# EAGLE design PDM_2019_RevB (EAGLE 9.1.3)

## Sheet 1 of 4
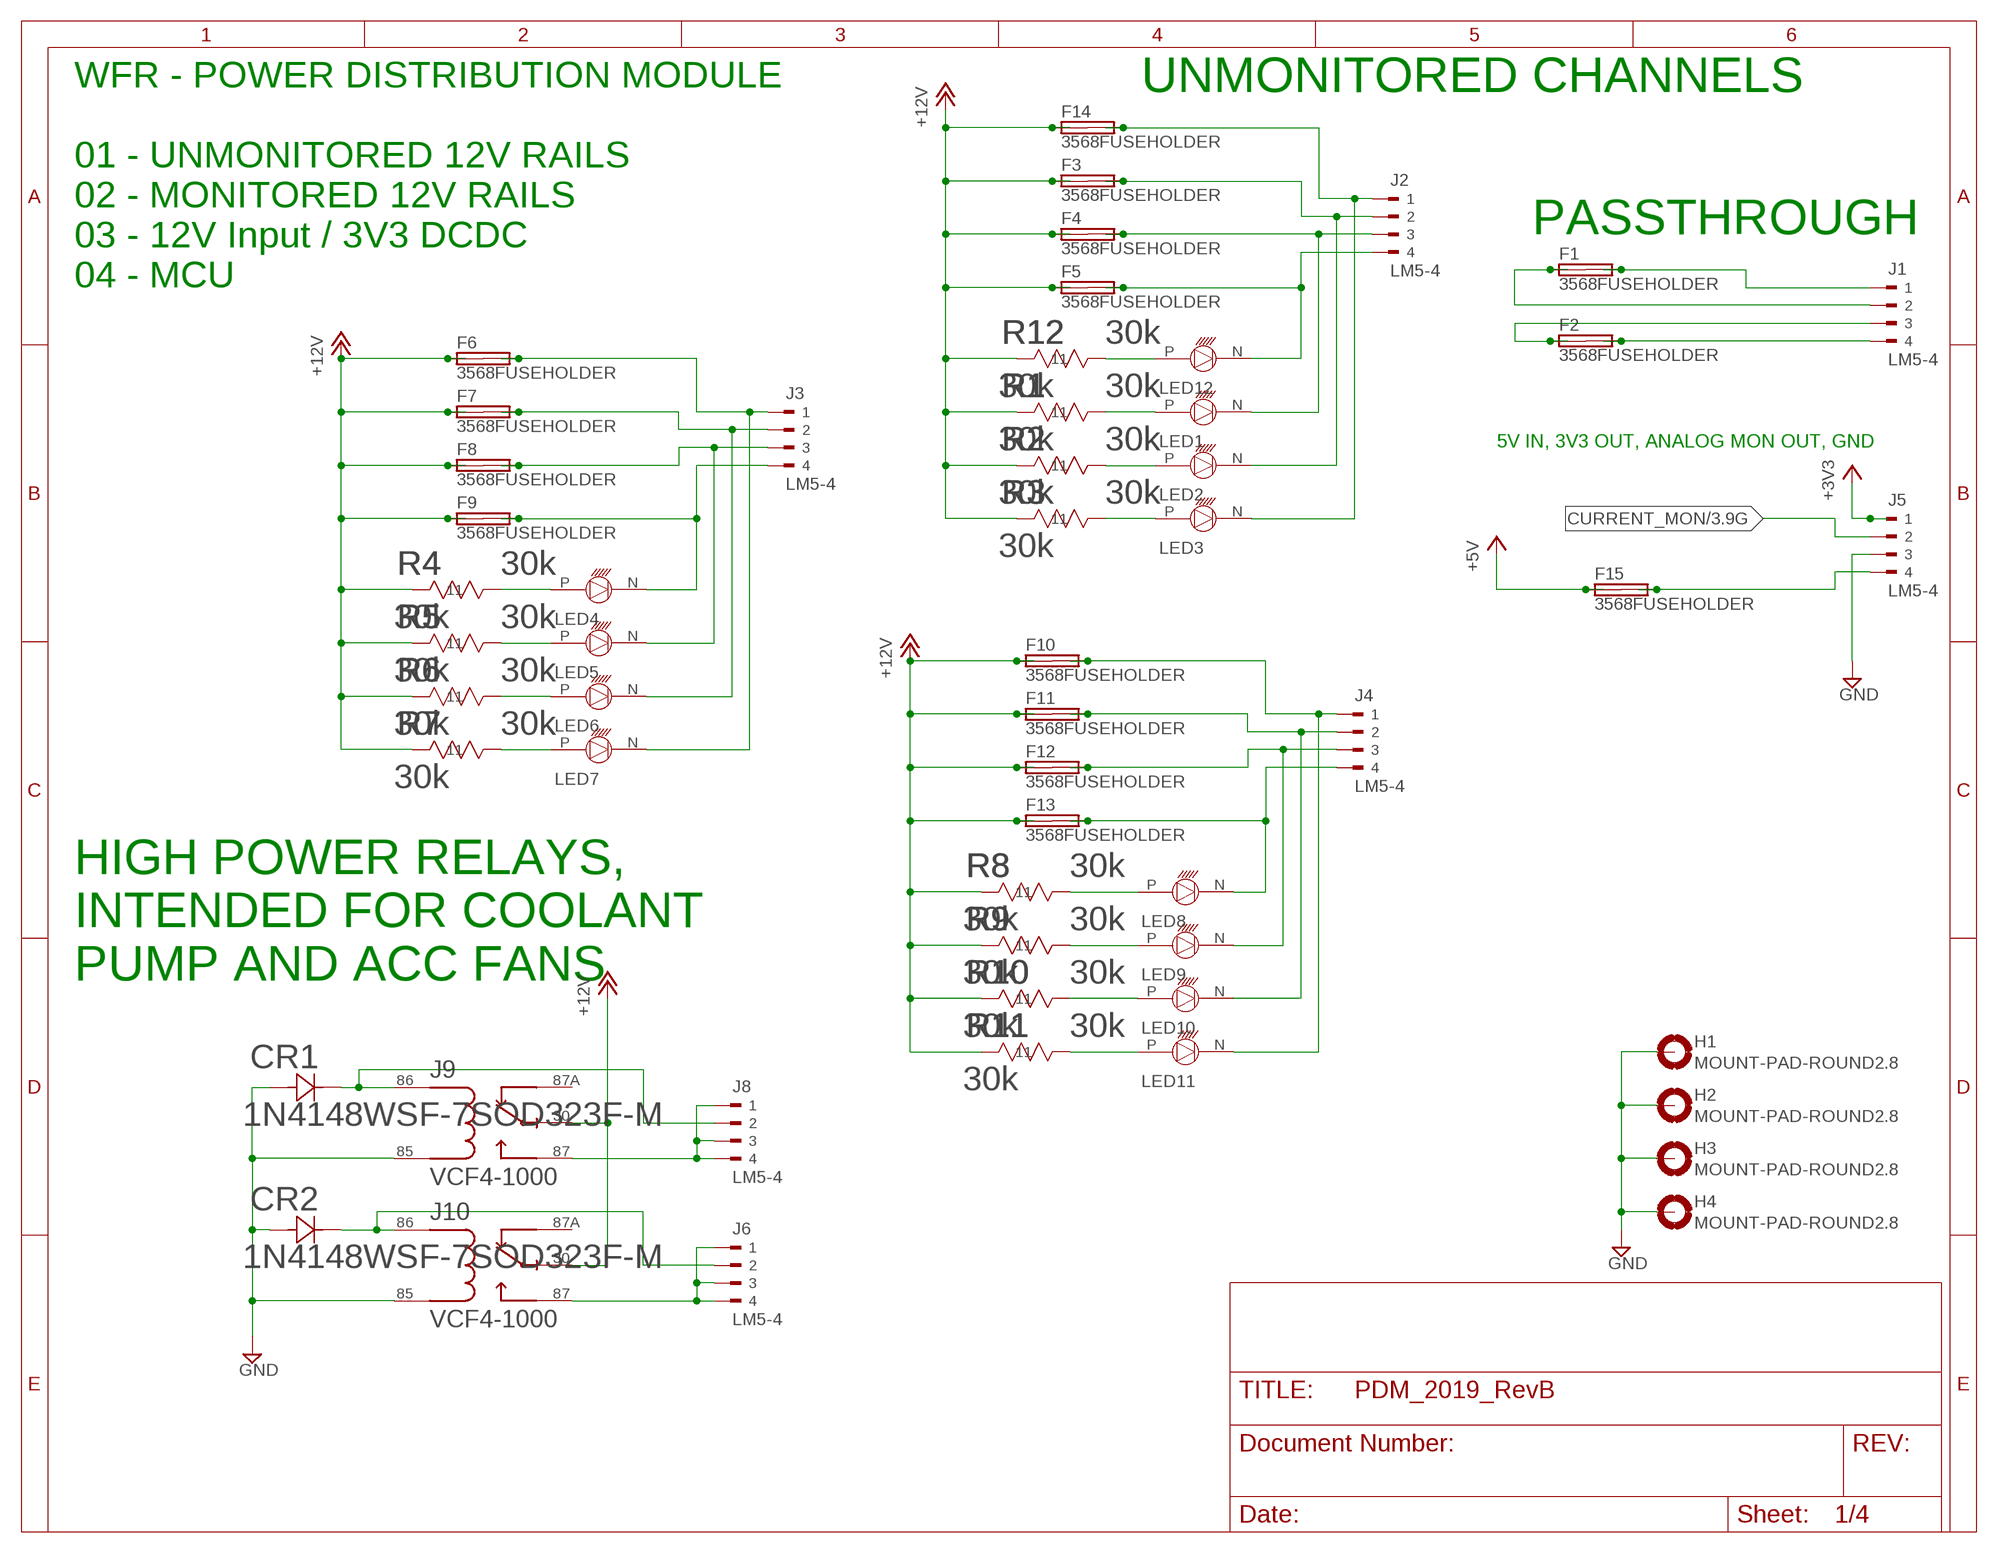
[diagram p0: schematic, sheet 1]

### Parts
CR1  1N4148WSF-7SOD323F-M  [SOD323F-M]
CR2  1N4148WSF-7SOD323F-M  [SOD323F-M]
F1  3568FUSEHOLDER  [3568]
F2  3568FUSEHOLDER  [3568]
F3  3568FUSEHOLDER  [3568]
F4  3568FUSEHOLDER  [3568]
F5  3568FUSEHOLDER  [3568]
F6  3568FUSEHOLDER  [3568]
F7  3568FUSEHOLDER  [3568]
F8  3568FUSEHOLDER  [3568]
F9  3568FUSEHOLDER  [3568]
F10  3568FUSEHOLDER  [3568]
F11  3568FUSEHOLDER  [3568]
F12  3568FUSEHOLDER  [3568]
F13  3568FUSEHOLDER  [3568]
F14  3568FUSEHOLDER  [3568]
F15  3568FUSEHOLDER  [3568]
H1  MOUNT-PAD-ROUND2.8  [2,8-PAD]
H2  MOUNT-PAD-ROUND2.8  [2,8-PAD]
H3  MOUNT-PAD-ROUND2.8  [2,8-PAD]
H4  MOUNT-PAD-ROUND2.8  [2,8-PAD]
J1  LM5-4  [281-1423]
J2  LM5-4  [281-1423]
J3  LM5-4  [281-1423]
J4  LM5-4  [281-1423]
J5  LM5-4  [281-1423]
J6  LM5-4  [281-1423]
J8  LM5-4  [281-1423]
J9  VCF4-1000  [TE_VCF4-1000]
J10  VCF4-1000  [TE_VCF4-1000]
LED1  5MM_LED  [5MM_LED]
LED2  5MM_LED  [5MM_LED]
LED3  5MM_LED  [5MM_LED]
LED4  5MM_LED  [5MM_LED]
LED5  5MM_LED  [5MM_LED]
LED6  5MM_LED  [5MM_LED]
LED7  5MM_LED  [5MM_LED]
LED8  5MM_LED  [5MM_LED]
LED9  5MM_LED  [5MM_LED]
LED10  5MM_LED  [5MM_LED]
LED11  5MM_LED  [5MM_LED]
LED12  5MM_LED  [5MM_LED]
R1  30k  RMCF0805JT30K0  [STA_RMCF0805]
R2  30k  RMCF0805JT30K0  [STA_RMCF0805]
R3  30k  RMCF0805JT30K0  [STA_RMCF0805]
R4  30k  RMCF0805JT30K0  [STA_RMCF0805]
R5  30k  RMCF0805JT30K0  [STA_RMCF0805]
R6  30k  RMCF0805JT30K0  [STA_RMCF0805]
R7  30k  RMCF0805JT30K0  [STA_RMCF0805]
R8  30k  RMCF0805JT30K0  [STA_RMCF0805]
R9  30k  RMCF0805JT30K0  [STA_RMCF0805]
R10  30k  RMCF0805JT30K0  [STA_RMCF0805]
R11  30k  RMCF0805JT30K0  [STA_RMCF0805]
R12  30k  RMCF0805JT30K0  [STA_RMCF0805]

### Nets
+3V3 [SIG]: J5.P$1 ; also sheet 3
+5V [SIG]: F15.L1(1A) F15.L2(1B) ; also sheet 2,3,4
+12V: F3.L1(1A) F3.L2(1B) F4.L1(1A) F4.L2(1B) F5.L1(1A) F5.L2(1B) F6.L1(1A) F6.L2(1B) F7.L1(1A) F7.L2(1B) F8.L1(1A) F8.L2(1B) F9.L1(1A) F9.L2(1B) F10.L1(1A) F10.L2(1B) F11.L1(1A) F11.L2(1B) F12.L1(1A) F12.L2(1B) F13.L1(1A) F13.L2(1B) F14.L1(1A) F14.L2(1B) J9.30 J10.30 R1.1 R2.1 R3.1 R4.1 R5.1 R6.1 R7.1 R8.1 R9.1 R10.1 R11.1 R12.1 ; also sheet 2,3
CURRENT_MON [SIG]: J5.P$2 ; also sheet 3,4
GND [SIG]: CR1.2 CR2.2 H1.B2,8(MOUNT) H2.B2,8(MOUNT) H3.B2,8(MOUNT) H4.B2,8(MOUNT) J5.P$3 J9.85 J10.85 ; also sheet 2,3,4
N$1: F1.R1(2A) F1.R2(2B) J1.P$1
N$2: F1.L1(1A) F1.L2(1B) J1.P$2
N$3: F2.L1(1A) F2.L2(1B) J1.P$3
N$4: LED11.P R11.2
N$5: LED12.P R12.2
N$6: F4.R1(2A) F4.R2(2B) J2.P$3 LED1.N
N$7: F5.R1(2A) F5.R2(2B) J2.P$4 LED12.N
N$9: F6.R1(2A) F6.R2(2B) J3.P$1 LED7.N
N$11: F8.R1(2A) F8.R2(2B) J3.P$3 LED5.N
N$12: F7.R1(2A) F7.R2(2B) J3.P$2 LED6.N
N$13: F10.R1(2A) F10.R2(2B) J4.P$1 LED11.N
N$14: F13.R1(2A) F13.R2(2B) J4.P$4 LED8.N
N$15: F12.R1(2A) F12.R2(2B) J4.P$3 LED9.N
N$16: F11.R1(2A) F11.R2(2B) J4.P$2 LED10.N
N$18: F15.R1(2A) F15.R2(2B) J5.P$4
N$19: LED10.P R10.2
N$21: LED8.P R8.2
N$22: CR2.1 J6.P$2 J10.86
N$23: CR1.1 J8.P$2 J9.86
N$24: LED9.P R9.2
N$25: F2.R1(2A) F2.R2(2B) J1.P$4
N$26: LED7.P R7.2
N$27: LED6.P R6.2
N$28: LED5.P R5.2
N$29: LED4.P R4.2
N$30: LED1.P R1.2
N$31: LED2.P R2.2
N$32: LED3.P R3.2
N$33: F3.R1(2A) F3.R2(2B) J2.P$2 LED2.N
N$34: F14.R1(2A) F14.R2(2B) J2.P$1 LED3.N
N$40: J6.P$1 J6.P$3 J6.P$4 J10.87
N$41: F9.R1(2A) F9.R2(2B) J3.P$4 LED4.N
N$43: J8.P$1 J8.P$3 J8.P$4 J9.87
Unconnected: J9.87A J10.87A

### Notes on the sheet
- UNMONITORED CHANNELS
- PASSTHROUGH
- WFR - POWER DISTRIBUTION MODULE
  
  01 - UNMONITORED 12V RAILS
  02 - MONITORED 12V RAILS
  03 - 12V Input / 3V3 DCDC
  04 - MCU
- 5V IN, 3V3 OUT, ANALOG MON OUT, GND
- HIGH POWER RELAYS,
  INTENDED FOR COOLANT 
  PUMP AND ACC FANS

## Sheet 2 of 4
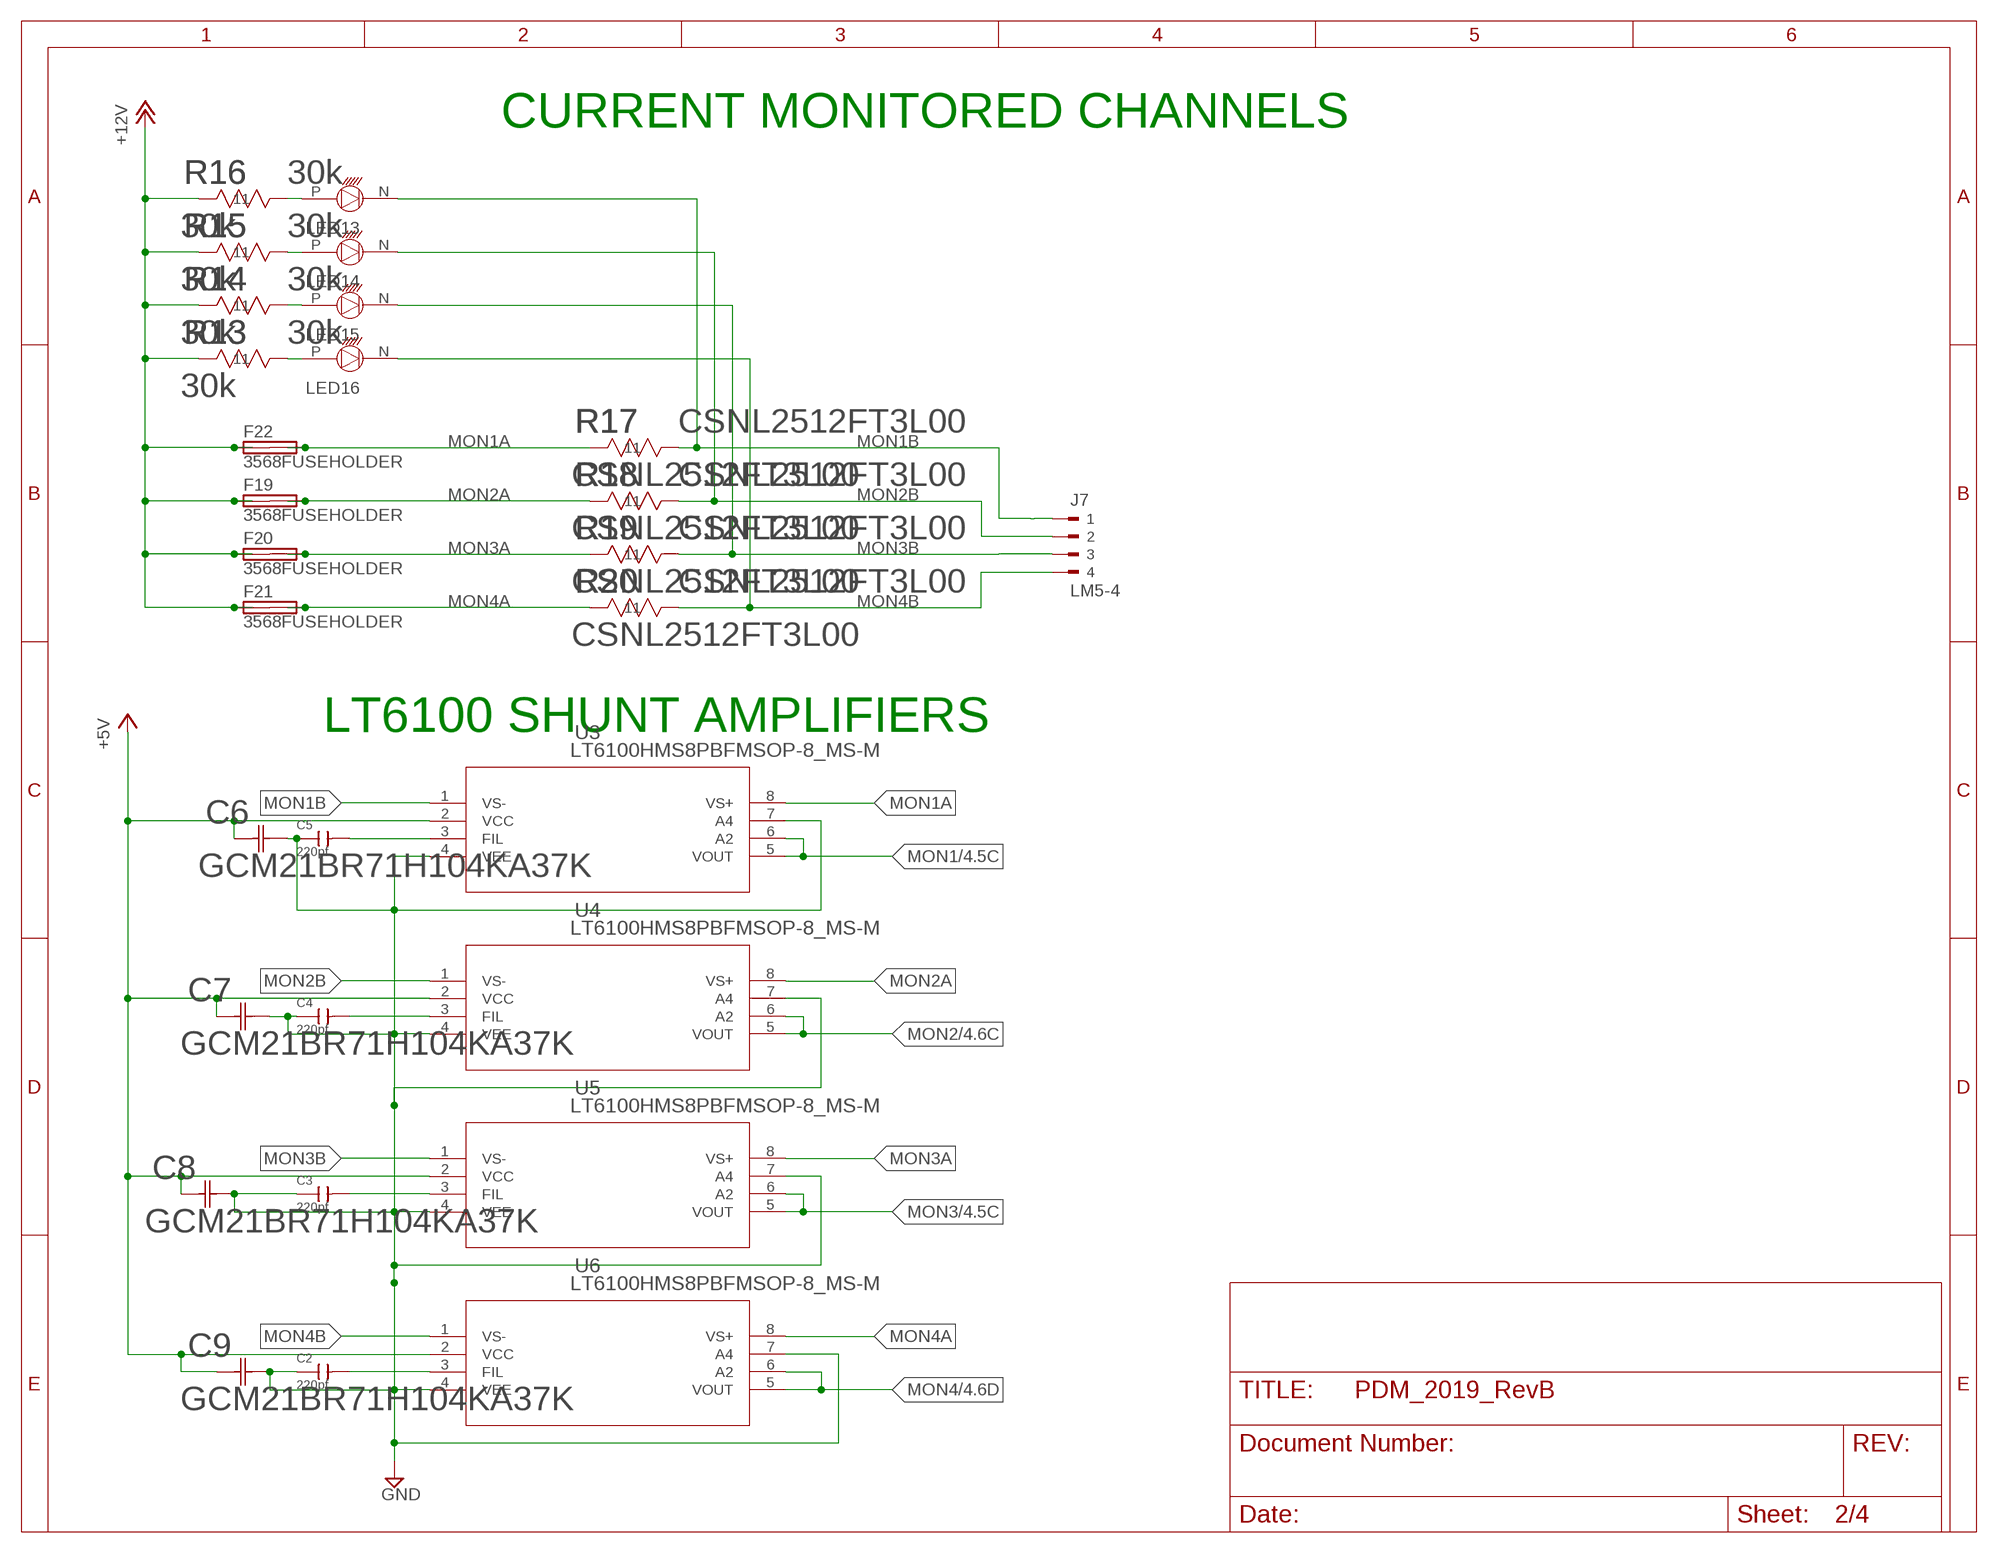
[diagram p1: schematic, sheet 2]

### Parts
C2  220pf  CERAMIC-220PF-50V-5%-NPO(0402)  [C0402]
C3  220pf  CERAMIC-220PF-50V-5%-NPO(0402)  [C0402]
C4  220pf  CERAMIC-220PF-50V-5%-NPO(0402)  [C0402]
C5  220pf  CERAMIC-220PF-50V-5%-NPO(0402)  [C0402]
C6  GCM21BR71H104KA37K  [G-21]
C7  GCM21BR71H104KA37K  [G-21]
C8  GCM21BR71H104KA37K  [G-21]
C9  GCM21BR71H104KA37K  [G-21]
F19  3568FUSEHOLDER  [3568]
F20  3568FUSEHOLDER  [3568]
F21  3568FUSEHOLDER  [3568]
F22  3568FUSEHOLDER  [3568]
J7  LM5-4  [281-1423]
LED13  5MM_LED  [5MM_LED]
LED14  5MM_LED  [5MM_LED]
LED15  5MM_LED  [5MM_LED]
LED16  5MM_LED  [5MM_LED]
R13  30k  RMCF0805JT30K0  [STA_RMCF0805]
R14  30k  RMCF0805JT30K0  [STA_RMCF0805]
R15  30k  RMCF0805JT30K0  [STA_RMCF0805]
R16  30k  RMCF0805JT30K0  [STA_RMCF0805]
R17  CSNL2512FT3L00  [STA_CSNL2512(3)]
R18  CSNL2512FT3L00  [STA_CSNL2512(3)]
R19  CSNL2512FT3L00  [STA_CSNL2512(3)]
R20  CSNL2512FT3L00  [STA_CSNL2512(3)]
U3  LT6100HMS8PBFMSOP-8_MS-M  [MSOP-8_MS-M]
U4  LT6100HMS8PBFMSOP-8_MS-M  [MSOP-8_MS-M]
U5  LT6100HMS8PBFMSOP-8_MS-M  [MSOP-8_MS-M]
U6  LT6100HMS8PBFMSOP-8_MS-M  [MSOP-8_MS-M]

### Nets
+5V [SIG]: C6.1 C7.1 C8.1 C9.1 U3.2(VCC) U4.2(VCC) U5.2(VCC) U6.2(VCC) ; also sheet 1,3,4
+12V: F19.L1(1A) F19.L2(1B) F20.L1(1A) F20.L2(1B) F21.L1(1A) F21.L2(1B) F22.L1(1A) F22.L2(1B) R13.1 R14.1 R15.1 R16.1 ; also sheet 1,3
GND [SIG]: C2.1 C3.1 C4.1 C5.1 C6.2 C7.2 C8.2 C9.2 U3.4(VEE) U3.7(A4) U4.4(VEE) U4.7(A4) U5.4(VEE) U5.7(A4) U6.4(VEE) U6.7(A4) ; also sheet 1,3,4
MON1 [SIG]: U3.5(VOUT) U3.6(A2) ; also sheet 4
MON1A [SIG]: F22.R1(2A) F22.R2(2B) R17.1 U3.8(VS+)
MON1B [SIG]: J7.P$1 LED13.N R17.2 U3.1(VS-)
MON2 [SIG]: U4.5(VOUT) U4.6(A2) ; also sheet 4
MON2A [SIG]: F19.R1(2A) F19.R2(2B) R18.1 U4.8(VS+)
MON2B [SIG]: J7.P$2 LED14.N R18.2 U4.1(VS-)
MON3 [SIG]: U5.5(VOUT) U5.6(A2) ; also sheet 4
MON3A [SIG]: F20.R1(2A) F20.R2(2B) R19.1 U5.8(VS+)
MON3B [SIG]: J7.P$3 LED15.N R19.2 U5.1(VS-)
MON4 [SIG]: U6.5(VOUT) U6.6(A2) ; also sheet 4
MON4A [SIG]: F21.R1(2A) F21.R2(2B) R20.1 U6.8(VS+)
MON4B [SIG]: J7.P$4 LED16.N R20.2 U6.1(VS-)
N$10 [SIG]: C5.2 U3.3(FIL)
N$17 [SIG]: C4.2 U4.3(FIL)
N$35 [SIG]: C2.2 U6.3(FIL)
N$36: LED16.P R13.2
N$37: LED15.P R14.2
N$38: LED14.P R15.2
N$39: LED13.P R16.2
N$42 [SIG]: C3.2 U5.3(FIL)

### Notes on the sheet
- CURRENT MONITORED CHANNELS
- LT6100 SHUNT AMPLIFIERS

## Sheet 3 of 4
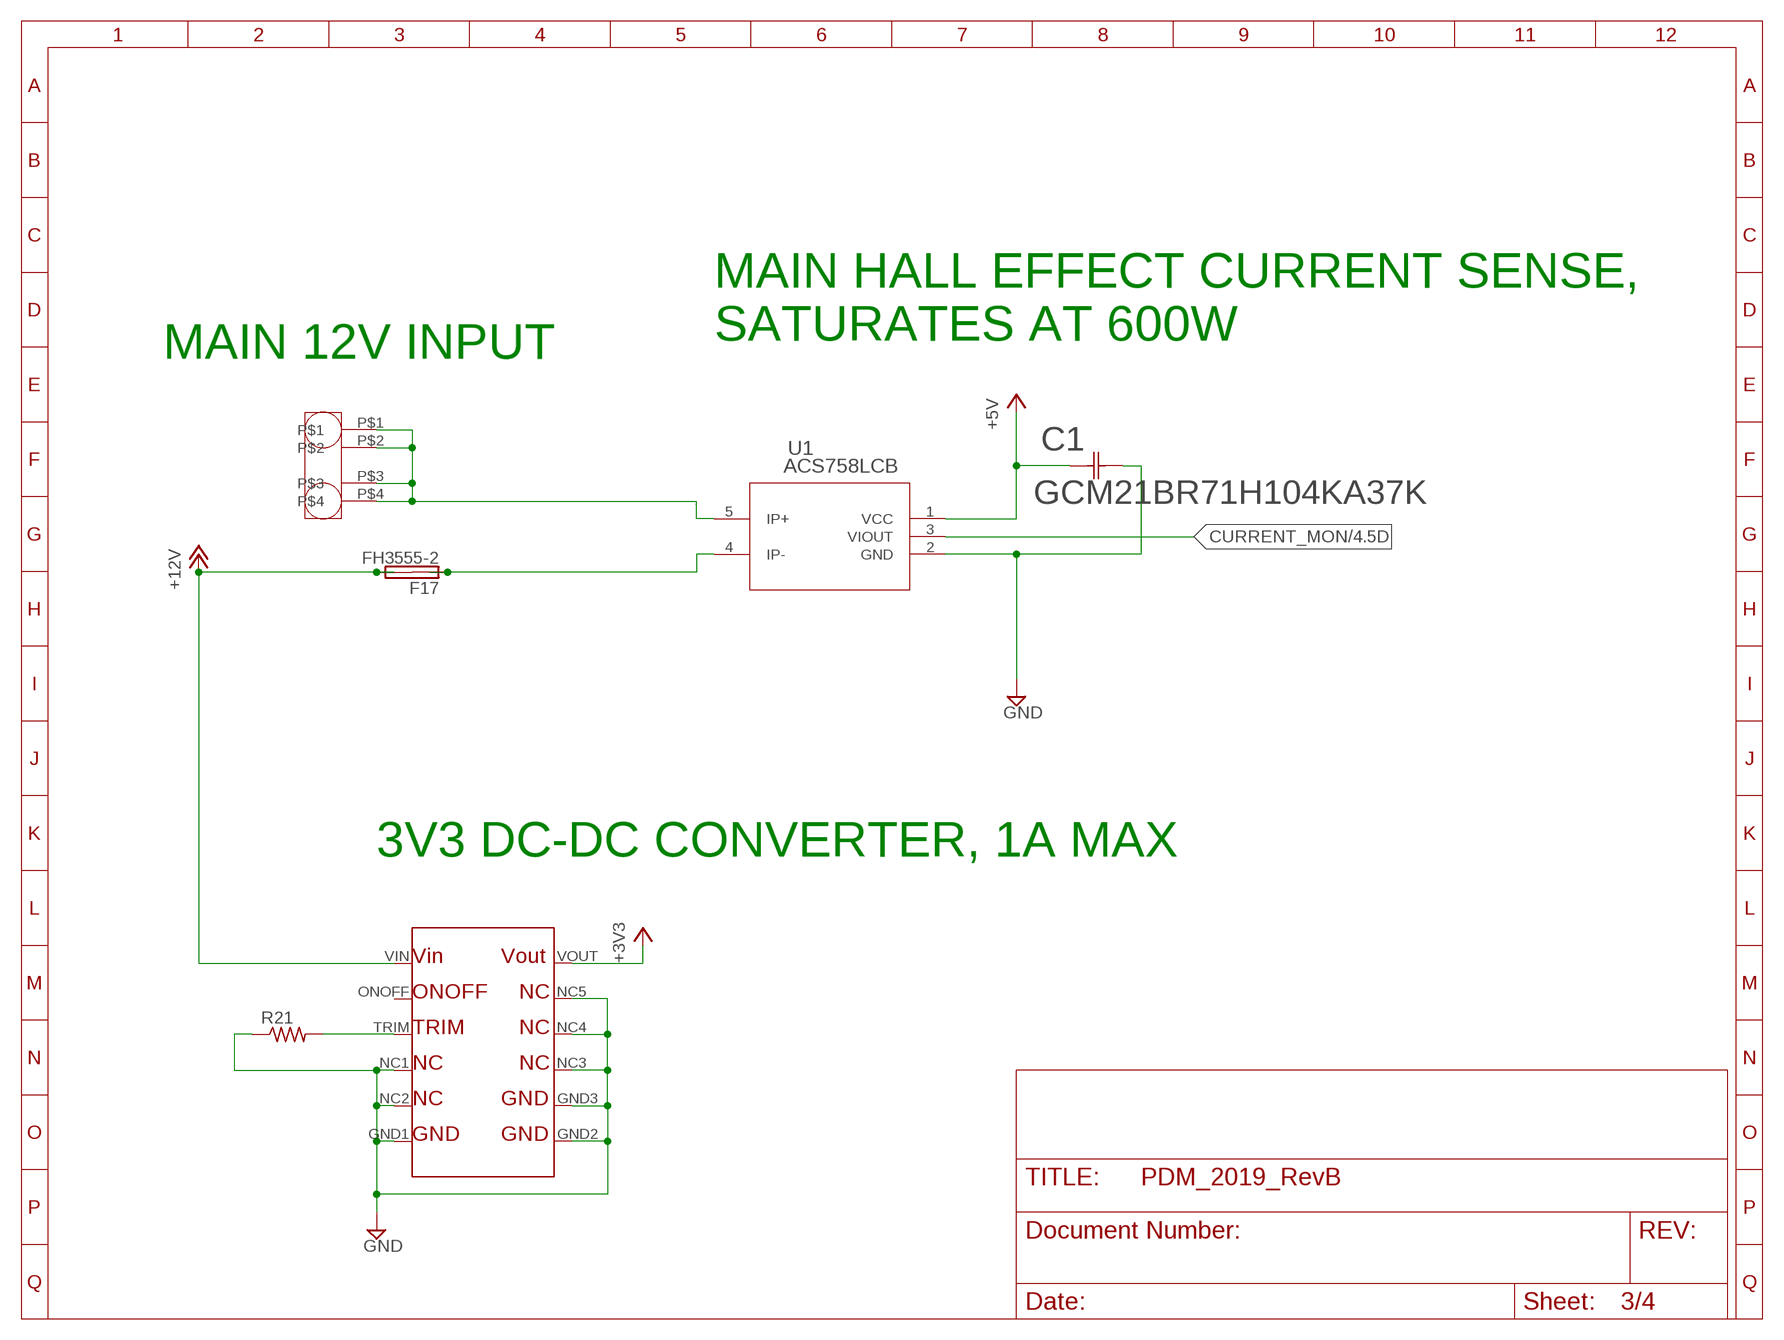
[diagram p2: schematic, sheet 3]

### Parts
C1  GCM21BR71H104KA37K  [G-21]
F17  FH3555-2  [3555-2]
R21  R-US_M0805  [M0805]
U1  ACS758LCB  [PFF-5]
U$1  1773976  [1773976]
U$2  OKL-T/1-W12N-C  [OKL-T/1-W12N-C]

### Nets
+3V3 [SIG]: U$2.VOUT ; also sheet 1
+5V [SIG]: C1.1 U1.1(VCC) ; also sheet 1,2,4
+12V: F17.R1(2A) F17.R2(2B) U$2.VIN ; also sheet 1,2
CURRENT_MON [SIG]: U1.3(VIOUT) ; also sheet 1,4
GND [SIG]: C1.2 R21.1 U1.2(GND) U$2.GND1 U$2.GND2 U$2.GND3 U$2.NC1 U$2.NC2 U$2.NC3 U$2.NC4 U$2.NC5 ; also sheet 1,2,4
N$8 [RAIL2]: U1.5(IP+) U$1.P$1 U$1.P$2 U$1.P$3 U$1.P$4
N$20 [RAIL2]: F17.L1(1A) F17.L2(1B) U1.4(IP-)
N$44 [SIG]: R21.2 U$2.TRIM
Unconnected: U$2.ONOFF

### Notes on the sheet
- MAIN HALL EFFECT CURRENT SENSE,
  SATURATES AT 600W
- MAIN 12V INPUT
- 3V3 DC-DC CONVERTER, 1A MAX

## Sheet 4 of 4
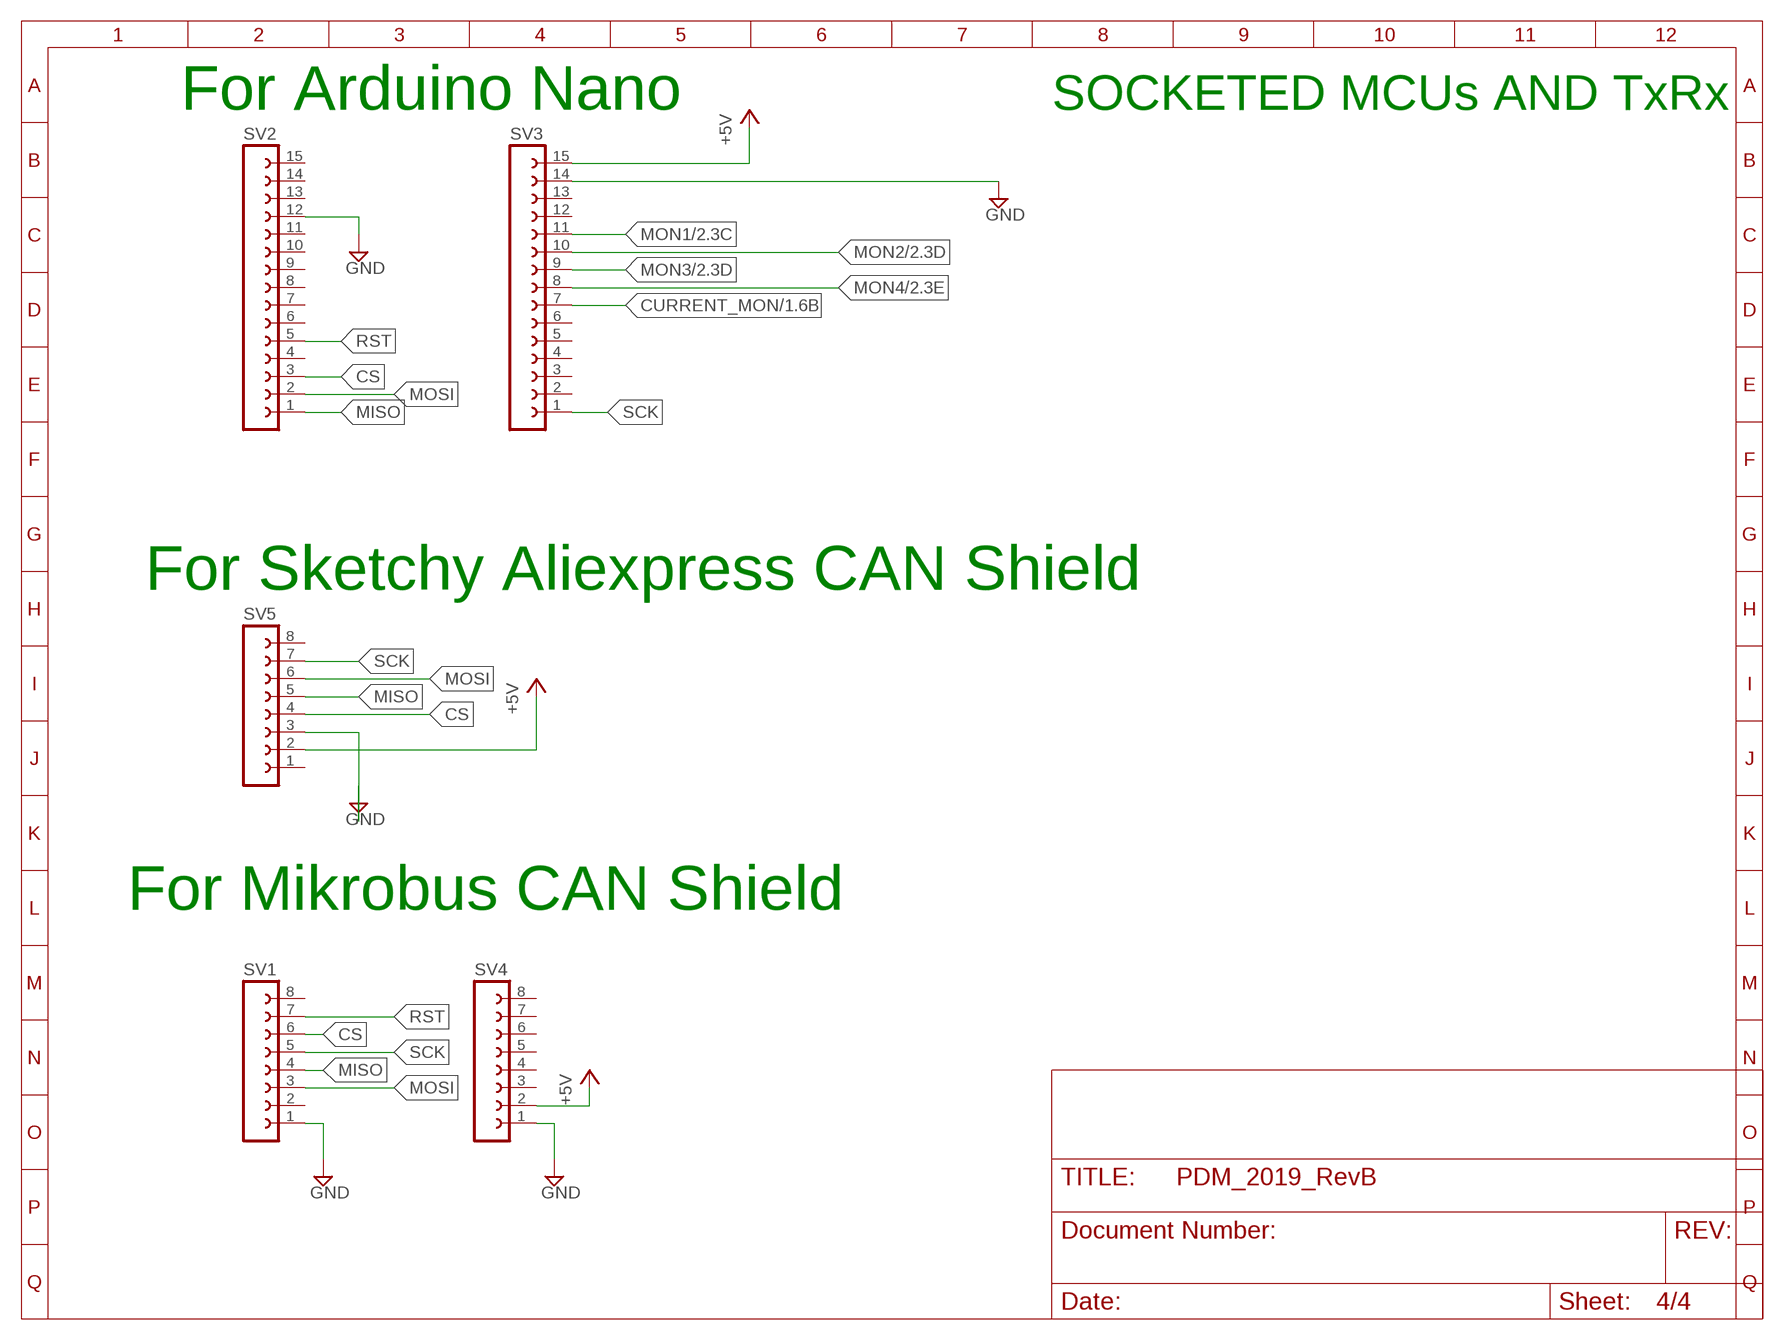
[diagram p3: schematic, sheet 4]

### Parts
SV1  FE08-1  [FE08]
SV2  FE15-1  [FE15]
SV3  FE15-1  [FE15]
SV4  FE08-1  [FE08]
SV5  FE08-1  [FE08]

### Nets
+5V [SIG]: SV3.15 SV4.2 ; also sheet 1,2,3
CS: SV1.6 SV2.3 SV5.4
CURRENT_MON [SIG]: SV3.7 ; also sheet 1,3
GND [SIG]: SV1.1 SV2.12 SV3.14 SV4.1 ; also sheet 1,2,3
MISO: SV1.4 SV2.1 SV5.5
MON1 [SIG]: SV3.11 ; also sheet 2
MON2 [SIG]: SV3.10 ; also sheet 2
MON3 [SIG]: SV3.9 ; also sheet 2
MON4 [SIG]: SV3.8 ; also sheet 2
MOSI: SV1.3 SV2.2 SV5.6
N$49: SV5.3
N$50: SV5.2 ; supply symbol labelled +5V
RST: SV1.7 SV2.5
SCK: SV1.5 SV3.1 SV5.7
Unconnected: SV1.2 SV1.8 SV2.4 SV2.6 SV2.7 SV2.8 SV2.9 SV2.10 SV2.11 SV2.13 SV2.14 SV2.15 SV3.2 SV3.3 SV3.4 SV3.5 SV3.6 SV3.12 SV3.13 SV4.3 SV4.4 SV4.5 SV4.6 SV4.7 SV4.8 SV5.1 SV5.8

### Notes on the sheet
- For Arduino Nano | SOCKETED MCUs AND TxRx
- For Sketchy Aliexpress CAN Shield
- For Mikrobus CAN Shield

## Library data of the parts
C1 C6-C9 = PDM_2019_RevB:GCM21BR71H104KA37K; MANUFACTURER_PART_NUMBER: GCM21BR71H104KA37K; VENDOR: Murata
C2-C5 = Seeed-Capacitor:CERAMIC-220PF-50V-5%-NPO(0402): 302010013; MPN: CC0402JRNPO9BN221
CR1 CR2 = PDM_2019_RevB:1N4148WSF-7; MANUFACTURER_PART_NUMBER: 1N4148WSF7; VENDOR: Diodes Inc
F1-F15 F19-F22 = fuse:3568FUSEHOLDER: 3568 20AMP 500VAC
F17 = fuse:FH3555-2
H1-H4 = holes:MOUNT-PAD-ROUND: MOUNTING PAD, round
J1-J8 = con-weidmueller-sl35:LM5-4
J9 J10 = PDM_2019_RevB:VCF4-1000: Socket, Relay; PCB, VTF Series, 1 Pole, Quick-Connect, w/o Grounding Provision; COMMENT: 1393310-3; DESCRIPTION: VCF4-1000=FROM SEC; DIGI-KEY_PART_NUMBER: PB232-ND; DIGI-KEY_PURCHASE_URL: https://www.digikey.ca/product-detail/en/te-connectivity-potter-brumfield-relays/VCF4-1000/PB232-ND/207273?utm_source=snapeda&utm_medium=aggregator&utm_campaign=symbol; MF: TE Connectivity; MP: VCF4-1000; PACKAGE: None; PRODUCT_TYPE: Socket; TE_PURCHASE_URL: https://www.te.com/usa-en/product-1393310-3.html?te_bu=Cor&te_type=disp&te_campaign=seda_glo_cor-seda-global-disp-prtnr-fy19-seda-model-bom-cta_sma-317_1&elqCampaignId=32493
LED1-LED16 = PDM_2019_RevB:5MM_LED
R1-R16 = PDM_2019_RevB:RMCF0805JT30K0; MANUFACTURER_PART_NUMBER: RMCF0805JT30K0; VENDOR: Stackpole International
R17-R20 = PDM_2019_RevB:CSNL2512FT3L00; MANUFACTURER_PART_NUMBER: CSNL2512FT3L00; VENDOR: Stackpole International
R21 = resistor:R-US_: RESISTOR, American symbol
SV1 SV4 SV5 = con-lsta:FE08-1: FEMALE HEADER; OC_FARNELL: unknown; OC_NEWARK: unknown
SV2 SV3 = con-lsta:FE15-1: FEMALE HEADER; OC_FARNELL: unknown; OC_NEWARK: unknown
U1 = PDM_2019_RevB:ACS758LCB; MANUFACTURER_PART_NUMBER: LLC; VENDOR: Allegro Microsystems Inc.
U3-U6 = PDM_2019_RevB:LT6100HMS8PBF; MANUFACTURER_PART_NUMBER: LT6100HMS8#PBF; VENDOR: Linear Technology
U$1 = PDM_2019_RevB:1773976
U$2 = PDM_2019_RevB:OKL-T/1-W12N-C

## Net classes
0 RAIL1: width 0.4 mm, drill 0.5 mm, clearance 0.5 mm
1 GND: width 0.4 mm, drill 0.5 mm, clearance 0.2 mm
2 RAIL2: width 0.4 mm, drill 0.5 mm, clearance 0.5 mm
3 SIG: width 0.3 mm, drill 0.5 mm, clearance 0.2 mm

## Board
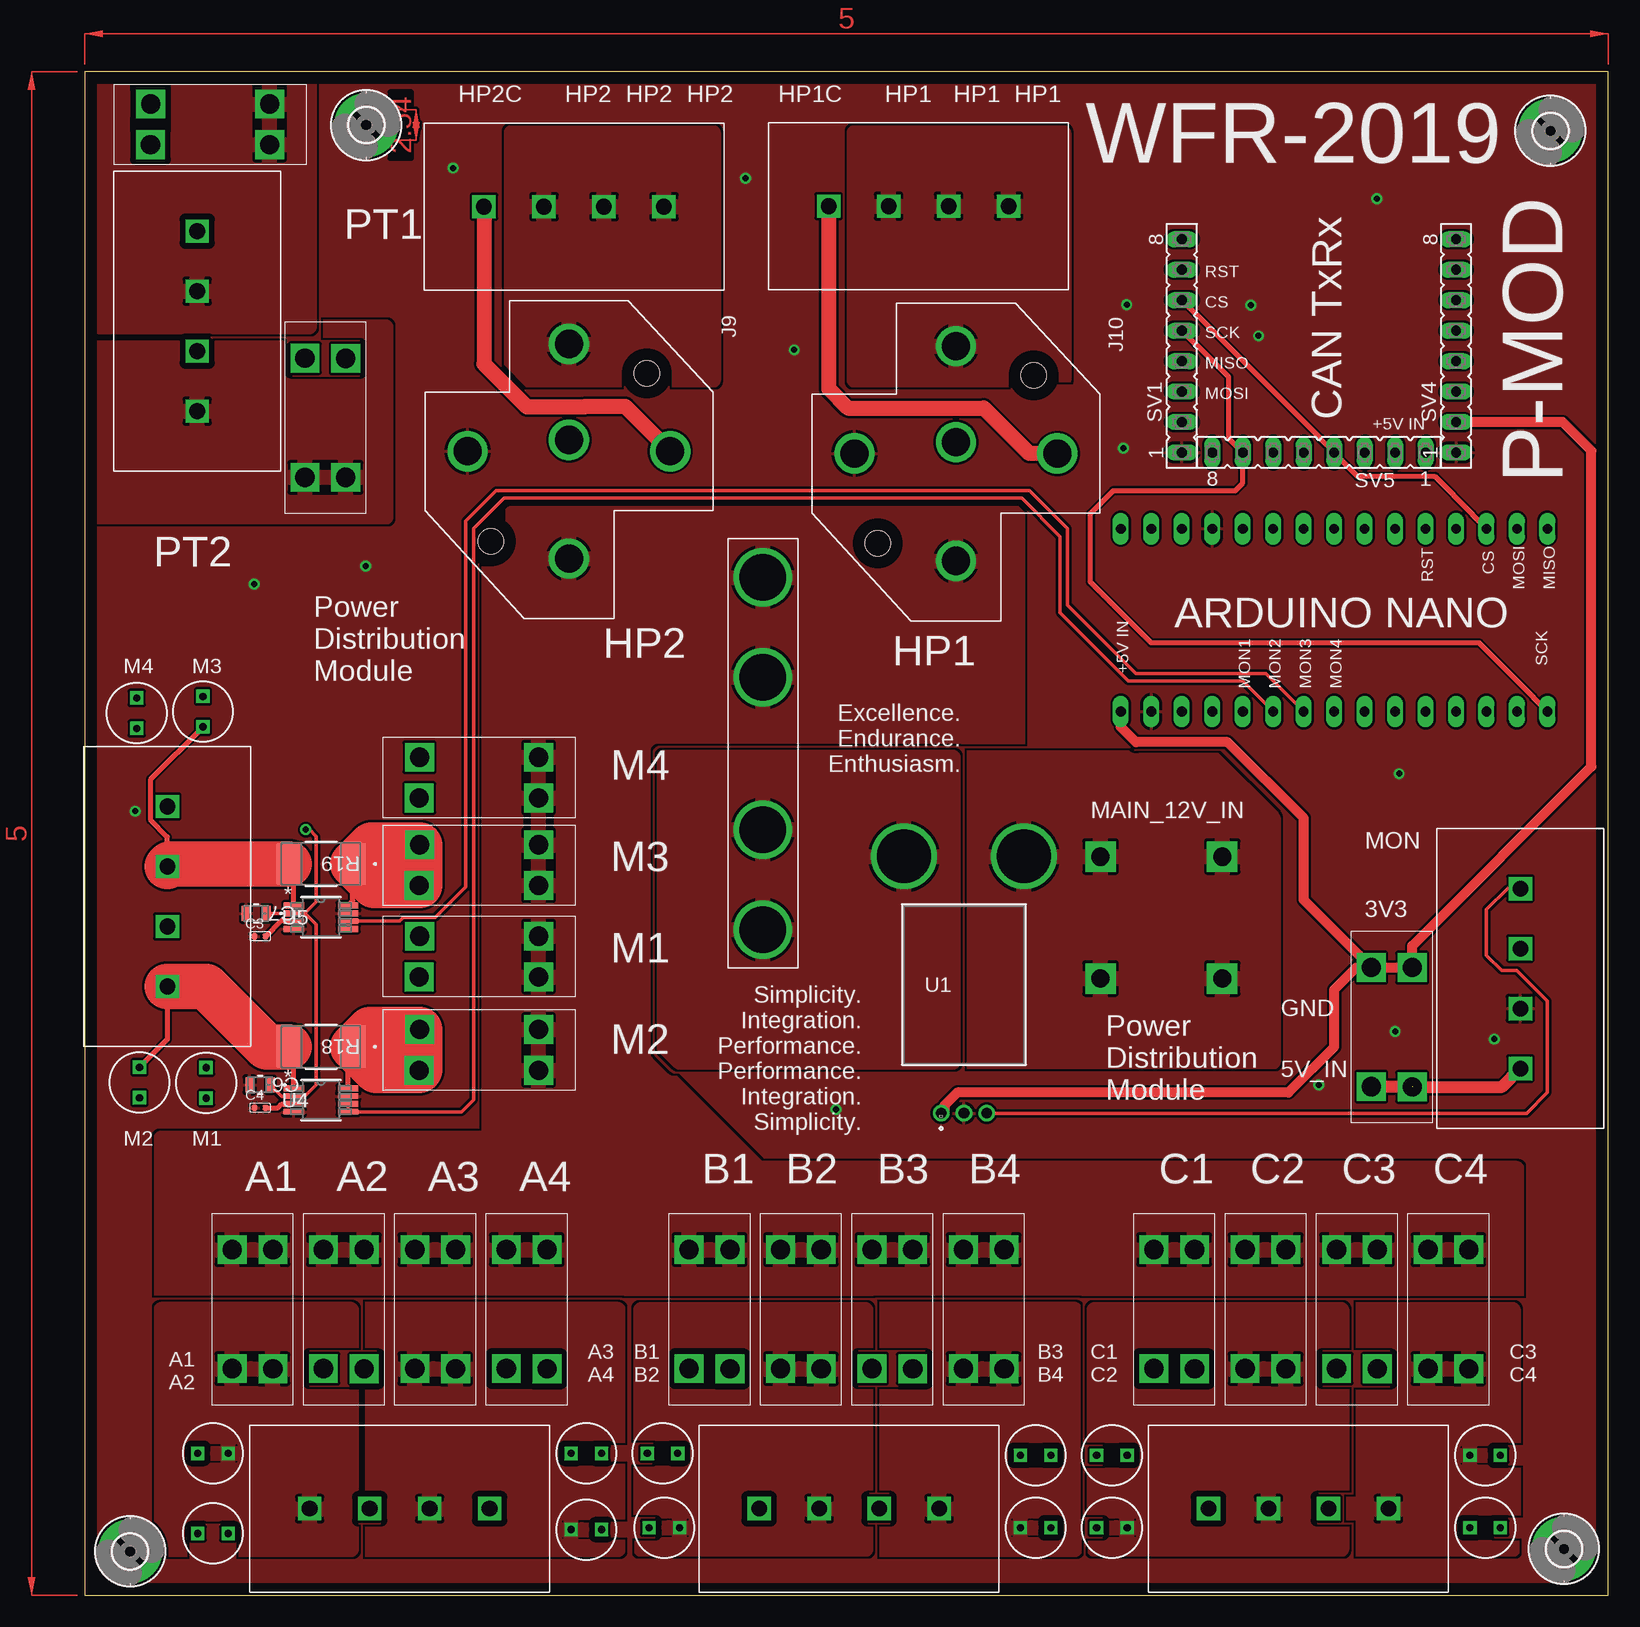
[diagram p4: board, top side]
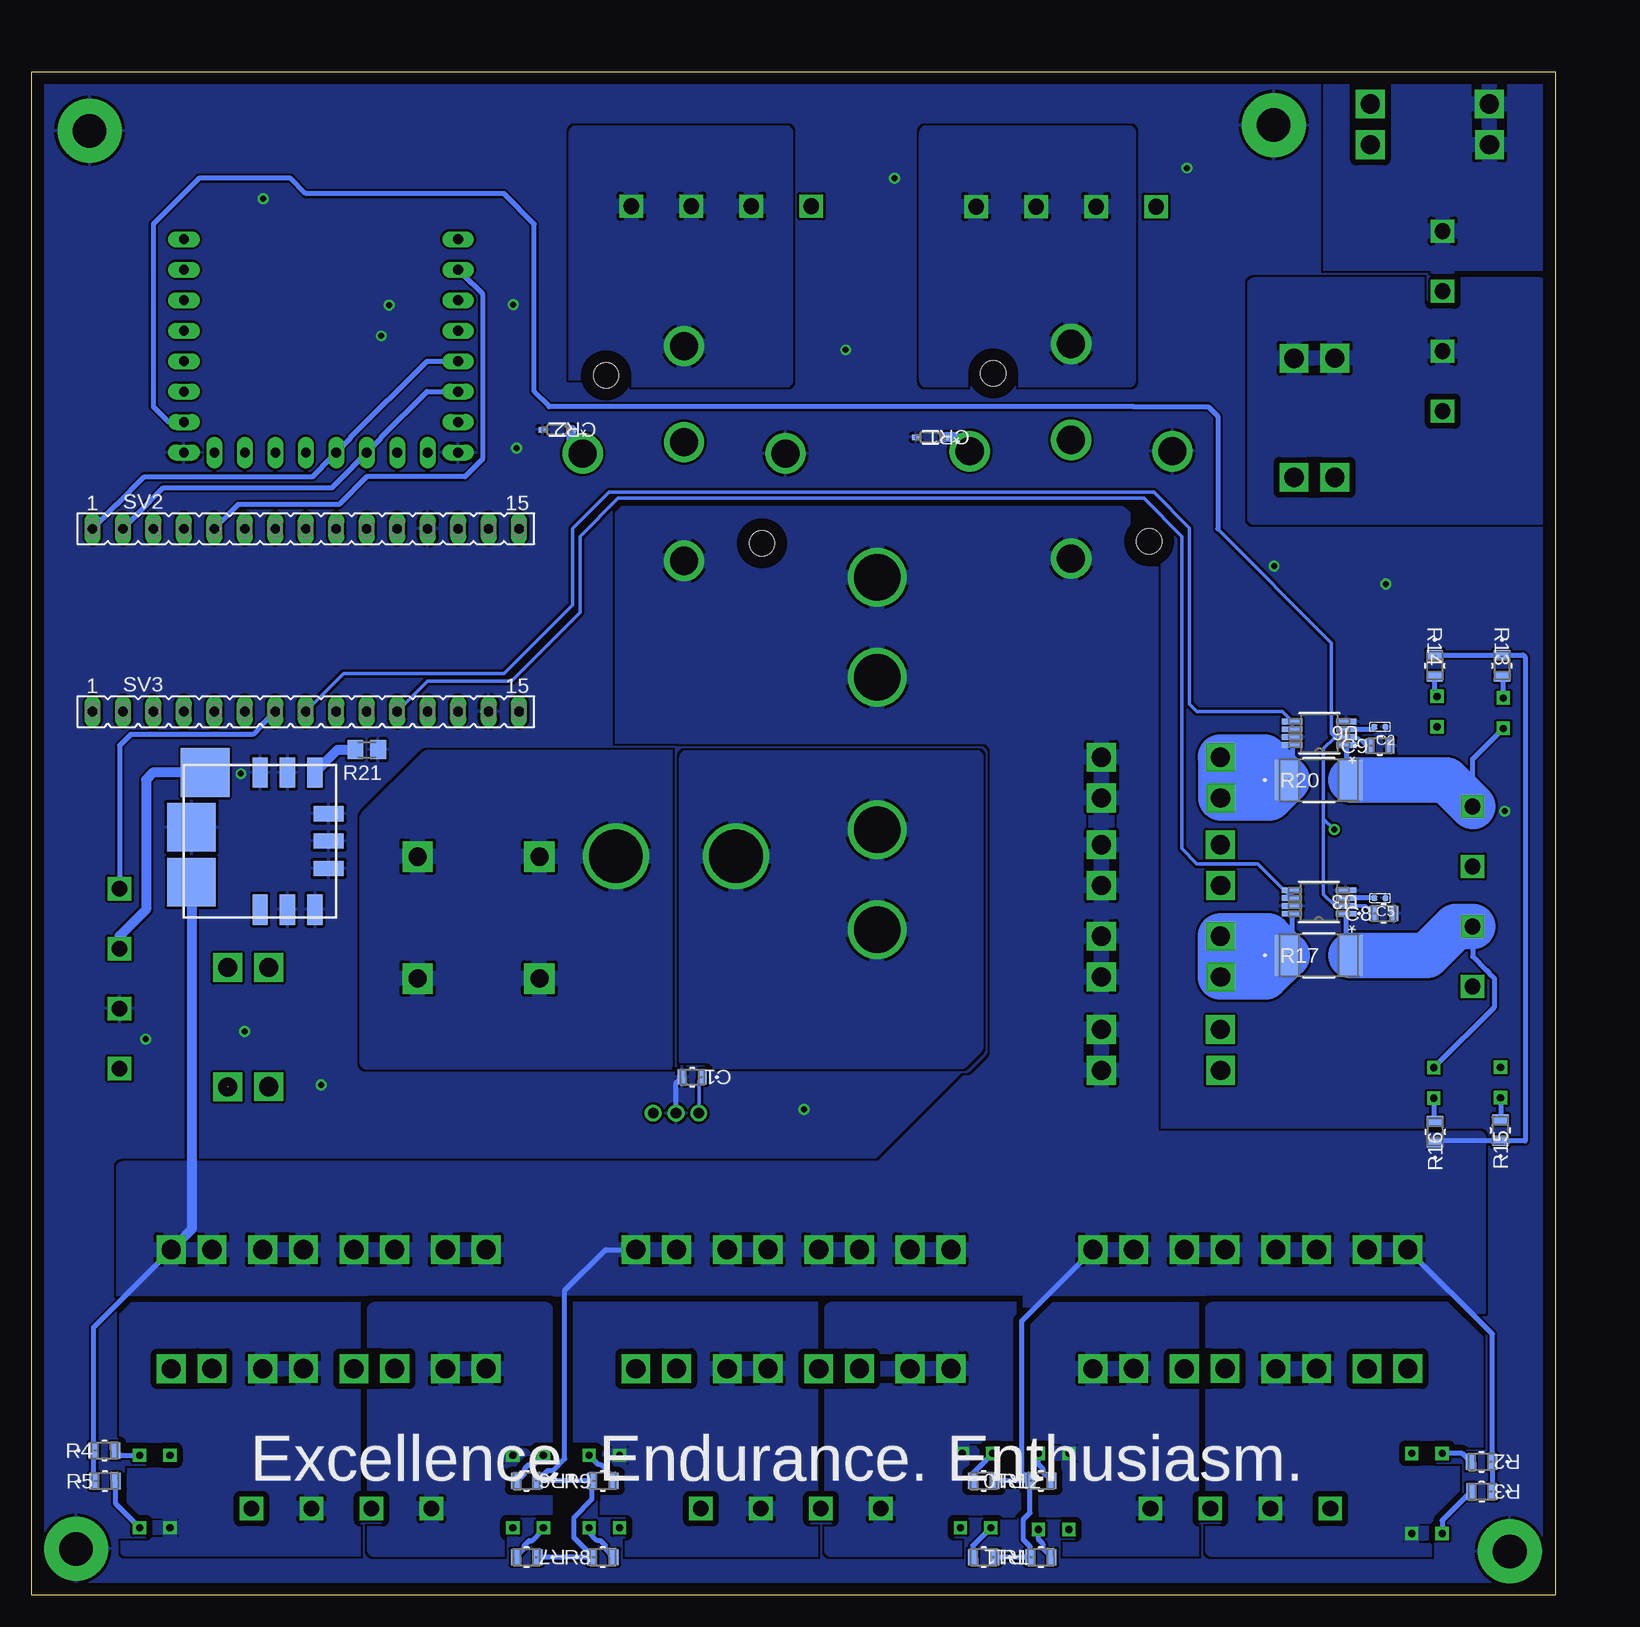
[diagram p5: board, bottom side, seen from below]

Size 127 x 127 mm. Coordinates in mm from the lower left corner, seen from the top.
Outline: 0,0 127,0 127,127 0,127 0,0
Copper layers (1*16): Top 0.035mm / dielectric 1.5mm / Bottom 0.035mm
Design rules "default": minimum track width 6mil, minimum drill 0.35mm, track to track 6mil, track to pad 6mil, pad to pad 6mil, via to via 6mil, smd to smd 6mil, copper to edge 40mil, drill to drill 6mil, minimum pad ring 10mil, minimum via ring 8mil, stop-mask expansion 4mil, vias tented up to drill 0mil, thermal gap 10mil

### Footprints (pad centres in the part's own frame; a part is rotated, then mirrored left to right if it is on the bottom)
G-21 = smd 0.711 x 1.245: 1 -0.851,0; 2 0.851,0
C0402 = smd 0.5 x 0.5: 1 0,0.463; 2 0,-0.463
SOD323F-M = smd 0.705 x 0.452: 1 -1.202,0; 2 1.202,0
3568 = drill 1.6 square: L1 0,3.4; L2 0,0; R1 9.94,3.4; R2 9.92,0
3555-2 = drill 3.86: L1 -14.68,0; L2 -6.35,0; R1 6.35,0; R2 14.68,0
2,8-PAD = drill 2.8 pad 5.334: B2,8 0,0
281-1423 = drill 1.3 square: P$1 -2.5,0; P$2 -7.5,0; P$3 2.5,0; P$4 7.5,0
TE_VCF4-1000 = drill 2.337: 30 8.95,0; 85 0,-8.45; 86 0,8.45; 87 -8.95,0; 87A -0.95,0 | hole 2.1: 7.5,-6.5; -6.5,6.5
5MM_LED = drill 0.6 square: N 0,-1.27; P 0,1.27
STA_RMCF0805 = smd 0.813 x 1.346: 1 -0.902,0; 2 0.902,0
STA_CSNL2512(3) = smd 2.032 x 3.429: 1 -2.642,0; 2 2.642,0
M0805 = smd 1.3 x 1.6: 1 -0.95,0; 2 0.95,0
FE08 = drill 0.813 long: 1 -8.89,0; 2 -6.35,0; 3 -3.81,0; 4 -1.27,0; 5 1.27,0; 6 3.81,0; 7 6.35,0; 8 8.89,0
FE15 = drill 0.813 long: 1 -17.78,0; 2 -15.24,0; 3 -12.7,0; 4 -10.16,0; 5 -7.62,0; 6 -5.08,0; 7 -2.54,0; 8 0,0; 9 2.54,0; 10 5.08,0; 11 7.62,0; 12 10.16,0; 13 12.7,0; 14 15.24,0; 15 17.78,0
PFF-5 = drill 0.889 pad 1.397: 1 -3.81,-21.412; 2 -1.905,-21.412; 3 0,-21.412 | drill 4.47 pad 4.978: 4 -6.909,0; 5 3.099,0
MSOP-8_MS-M = smd 1.702 x 0.483: 1 -2.261,0.975; 2 -2.261,0.325; 3 -2.261,-0.325; 4 -2.261,-0.975; 5 2.261,-0.975; 6 2.261,-0.325; 7 2.261,0.325; 8 2.261,0.975
1773976 = drill 1.51 pad 2.54 square: P$1 0,0; P$2 0,10.16; P$3 10.16,10.16; P$4 10.16,0
OKL-T/1-W12N-C = smd 4.064 x 4.064: GND1 1.143,5.715; VIN -3.429,5.715; VOUT 5.715,4.572 | smd 1.27 x 2.54: GND2 0,-5.715; NC3 -2.286,-5.715; NC4 2.286,-5.715 | smd 2.54 x 1.27: GND3 5.715,-2.286; NC1 -5.715,-2.286; NC2 -5.715,-4.572; NC5 5.715,0; ONOFF -5.715,0; TRIM 5.715,-4.572

### Placement (x,y rotation side)
C1  71.93,43.19 180 bottom
C2  14.61,72.39 270 bottom
C3  14.61,54.93 90 top
C4  14.61,40.64 90 top
C5  14.61,58.1 270 bottom
C6  14.61,42.55 180 top
C7  14.29,56.83 180 top
C8  14.29,56.83 0 bottom
C9  14.61,70.8 0 bottom
CR1  52.07,96.52 180 bottom
CR2  83.19,97.16 180 bottom
F1  21.75,93.19 90 top
F2  15.4,124.3 180 top
F3  12.27,28.8 270 top
F4  27.51,28.8 270 top
F5  35.13,28.8 270 top
F6  96.72,28.8 270 top
F7  89.1,28.8 270 top
F8  104.34,28.8 270 top
F9  111.96,28.8 270 top
F10  57.99,28.8 270 top
F11  50.37,28.8 270 top
F12  65.61,28.8 270 top
F13  73.23,28.8 270 top
F14  19.89,28.8 270 top
F15  107.25,52.32 270 top
F17  56.52,70.17 90 top
F19  37.81,47.16 180 top
F20  37.81,62.55 180 top
F21  37.81,69.86 180 top
F22  37.81,54.93 180 top
H1  123.29,3.85 0 top
H2  23.45,122.56 0 top
H3  3.77,3.64 0 top
H4  122.17,122.07 0 top
J1  9.37,106.2 90 top
J2  26.24,7.21 0 top
J3  101.17,7.21 0 top
J4  63.7,7.21 0 top
J5  119.67,51.4 270 top
J6  69.5,115.79 0 top
J7  6.87,58.24 90 top
J8  40.77,115.75 0 top
J9  40.35,95.36 270 top
J10  72.61,95.17 270 top
LED1  41.8,5.47 270 top
LED2  10.68,11.82 90 top
LED3  10.68,5.15 90 top
LED4  116.73,11.66 270 top
LED5  116.73,5.63 270 top
LED6  85.61,11.66 90 top
LED7  85.61,5.63 90 top
LED8  79.26,5.63 270 top
LED9  79.26,11.66 270 top
LED10  48.15,11.82 90 top
LED11  48.3,5.63 90 top
LED12  41.8,11.82 270 top
LED13  10.1,42.71 180 top
LED14  4.55,42.74 180 top
LED15  9.84,73.65 0 top
LED16  4.32,73.53 0 top
R1  42.86,3.17 0 bottom
R2  6.13,11.12 180 bottom
R3  6.11,8.64 180 bottom
R4  120.92,12.06 0 bottom
R5  120.87,9.51 0 bottom
R6  85.72,9.53 180 bottom
R7  85.72,3.17 180 bottom
R8  79.38,3.17 0 bottom
R9  79.38,9.53 0 bottom
R10  47.62,9.53 180 bottom
R11  47.62,3.17 180 bottom
R12  42.86,9.53 0 bottom
R13  4.43,77.48 270 bottom
R14  10.03,77.48 270 bottom
R15  4.55,38.75 90 bottom
R16  10,38.63 90 bottom
R17  19.68,53.34 0 bottom
R18  19.68,45.72 180 top
R19  19.68,60.96 180 top
R20  19.68,67.94 0 bottom
R21  99.06,70.48 180 bottom
SV1  91.44,104.14 90 top
SV2  104.14,88.9 0 bottom
SV3  104.14,73.66 0 bottom
SV4  114.3,104.14 90 top
SV5  102.87,95.25 180 top
U1  75.18,61.59 0 top
U3  19.68,57.78 180 bottom
U4  19.68,41.27 0 top
U5  19.68,56.52 0 top
U6  19.66,71.86 180 bottom
U$1  94.82,61.56 180 top
U$2  107.95,62.87 90 bottom

### Tracks (layer width: path | path; a pad name or v marks a point on that pad's centre or on a via)
+3V3
  Bottom 0.813: J5.P$1 119.67,54.61 119.67,54.96 117.45,57.18 117.45,67.97 116.84,68.58 U$2.VOUT
+5V  (via drill 0.5)
  Top 0.3: 18.41,56.78 18.42,56.78 19.3,55.9 19.3,54.61 | 18.41,56.78 17.48,56.78 U5.2 C7.1 | 19.3,54.61 19.3,42.54 18.42,41.66 17.48,41.66 U4.2 16.4,41.6 C6.1 | 18.41,56.78 18.41,56.89 19.3,57.78 19.3,63.25 18.73,63.82 v18.41,63.82 | 19.27,54.61 19.3,54.61
  Top 0.4: 71.88,40.76 71.88,40.69 71.48,40.28 U1.1
  Top 0.813: SV3.15 86.36,72.39 87.63,71.12 95.25,71.12 101.6,64.77 101.6,57.96 F15.L2 | 71.48,40.28 71.67,40.48 71.67,40.85 72.74,41.91 100.33,41.91 104.14,45.72 104.14,50.48 105.97,52.32 F15.L2 | SV4.2 123.19,97.79 125.58,95.4 125.58,69.06 110.64,54.13 F15.L1 F15.L2
  Bottom 0.3: 70.87,42.98 C1.1 71.37,42.89 U1.1 | 17.46,71.47 18.39,71.47 19.3,70.57 19.3,64.7 | 17.46,71.47 U6.2 17.46,71.59 18.39,71.59 18.63,71.83 18.63,79.39 28.12,88.88 | 19.3,64.7 v18.41,63.82 | 15.63,70.63 C9.1 15.73,70.8 16.4,71.47 17.46,71.47 | 19.3,64.7 19.3,58.4 18.42,57.52 17.48,57.52 U3.2 15.77,57.46 C7.1
  Bottom 0.4: 35.12,99.06 83.86,99.06
  Bottom 0.406: 35.12,99.06 28.91,99.06 28.12,98.27 28.12,88.88 | 83.86,99.06 83.86,99.1 85.09,100.33 85.09,114.3 87.63,116.84 104.14,116.84 105.41,118.11 113.03,118.11 116.84,114.3 116.84,99.06 115.57,97.79 SV4.2
+12V
  Bottom 0.4: R7.1 R8.1 80.28,3.27 81.78,4.78 81.78,6.47 80.28,7.98 R9.1 R6.1 83.94,10.4 83.5,10.4 82.55,11.35 82.55,25.4 79.15,28.8 F13.L1 | R11.1 R1.1 43.76,4.07 44.32,4.62 44.32,6.31 43.76,6.87 R12.1 | R12.1 R10.1 | R12.1 44.45,10.21 44.45,22.88 F5.L1 | R3.1 5.21,11.09 R2.1 5.23,21.77 F3.L2 | R5.1 121.83,9.56 R4.1 121.83,22.34 F9.L1 | R14.1 R13.1 2.67,78.38 2.49,78.2 | 2.49,37.85 R15.1 9.87,37.85 R16.1
  Bottom 0.406: 2.49,78.2 2.49,37.85
  Bottom 0.813: U$2.VIN 113.67,59.05 113.67,30.5 F9.L1
  pour Top (rank 5): 6.35,23.81 119.38,23.81 119.38,35.56 56.2,35.56 48.26,43.5 48.26,70.17 77.79,70.17 77.79,86.36 77.79,90.17 35.56,90.17 33.66,88.27 33.66,38.1 6.35,38.1
  pour Bottom (rank 5): 6.35,23.81 6.35,38.1 33.66,38.1 33.66,87.63 36.2,90.17 77.79,90.17 77.79,83.82 77.79,70.17 48.26,70.17 48.26,43.5 56.2,35.56 119.38,35.56 119.38,23.81
CS
  Top 0.406: SV2.3 115.66,90.08 115.66,90.12 112.56,93.23 106.11,93.23 104.14,95.2 SV5.4 102.96,96.43 102.96,96.47 92.67,106.77 92.62,106.77 SV1.6
CURRENT_MON
  Top 0.3: U1.3 120.19,40.18 121.92,41.91 121.92,49.53 119.38,52.07 118.11,52.07 116.84,53.34 116.84,57.15 118.59,58.9 J5.P$2
  Bottom 0.4: J5.P$2 119.67,70.83 118.75,71.75 108.54,71.75 107.86,72.44 107.86,72.48 SV3.7
GND  (via drill 0.5)
  Bottom 0.4: U1.2 73.28,42.69 C1.2 | 31.35,95.36 J9.85
  other vias: 4.19,65.35 14.12,84.3 23.42,85.78 30.68,118.97 55.07,118.11 59.13,103.81 86.56,95.63 62.61,40.49 109.55,68.48 97.84,104.98 97.18,107.54 86.84,107.57 107.7,116.41 102.87,42.55 109.22,46.99 117.47,46.35
  pour Bottom (rank 6): 0,0 0,127 127,127 127,0
  pour Top (rank 6): 0,0.32 0,127 127,127 127,0.32
MISO
  Bottom 0.406: SV2.1 120.74,90.08 120.74,90.12 119.94,90.92 119.9,90.92 117.59,93.23 103.58,93.23 102.78,94.03 102.78,94.07 SV5.5 100.42,96.43 100.42,96.47 94.03,102.87 SV1.4 92.08,102.87
MON1
  Bottom 0.3: U3.5 U3.6 24.8,60.96 29.84,60.96 31.11,62.23 31.11,88.27 34.29,91.44 78.11,91.44 81.28,88.27 81.28,81.92 87,76.2 93.98,76.2 SV3.11
MON1A
  Bottom 0.406: U3.8 21.95,53.72 R17.1
  Bottom 3.81: F22.R2 27.89,51.55 F22.R1 24.13,51.53 R17.1 23.92,54.93 F22.R2
MON1B
  Bottom 0.406: U3.1 17.42,53.72 R17.2 | J7.P$1 6.87,53.23 5.76,52.12 5.73,52.12 5.49,51.88 5.49,51.85 5.08,51.44 5.08,49 LED13.N
  Bottom 3.81: J7.P$1 8.29,55.74 10.69,53.34 R17.2
MON2
  Top 0.3: U4.6 U4.5 31.41,40.3 32.38,41.27 32.38,88.9 34.92,91.44 78.11,91.44 81.28,88.27 81.28,81.92 87,76.2 96.52,76.2 SV3.10
MON2A
  Top 0.406: U4.8 21.95,45.34 R18.1
  Top 3.81: F19.R2 23.76,47.16 R18.1 24.29,43.76 F19.R1 27.89,43.77 F19.R2
MON2B
  Top 0.406: U4.1 17.42,45.34 R18.2 | J7.P$2 6.87,46.33 LED14.N
  Top 3.81: J7.P$2 10.12,50.74 15.14,45.72 R18.2
MON3
  Top 0.3: U5.5 U5.6 26.25,56.19 26.55,56.48 29.18,56.48 31.75,59.05 31.75,89.53 34.29,92.08 78.74,92.08 81.92,88.9 81.92,82.55 87.63,76.83 98.42,76.83 SV3.9
MON3A
  Top 0.406: U5.8 22.33,57.87 R19.1
  Top 3.81: F20.R2 27.89,59.17 F20.R1 24.13,59.15 R19.1 23.92,62.55 F20.R2
MON3B
  Top 0.406: U5.1 17.42,60.58 R19.2 | J7.P$3 6.87,63.22 5.49,64.6 5.49,68.03 LED15.N
  Top 3.81: R19.2 7.09,60.96 J7.P$3
MON4
  Bottom 0.3: U6.6 U6.5 22.75,73.66 29.84,73.66 30.48,74.3 30.48,88.97 33.45,91.94 78.88,91.94 81.92,88.9 81.92,82.55 87.63,76.83 100.97,76.83 SV3.8
MON4A
  Bottom 0.406: U6.8 21.92,68.35 R20.1
  Bottom 3.81: F21.R1 27.87,69.84 F21.R2 24.24,69.86 R20.1 23.82,66.46 F21.R1
MON4B
  Bottom 0.406: U6.1 17.4,68.3 R20.2 | J7.P$4 6.87,69.71 LED16.N
  Bottom 3.81: R20.2 9.07,67.94 J7.P$4
MOSI
  Bottom 0.406: SV2.2 118.2,90.08 118.2,90.12 116.01,92.32 101.94,92.32 100.24,94.03 100.24,94.07 SV5.6 97.88,96.43 97.88,96.47 94.03,100.33 SV1.3 92.71,100.33
N$1
  pour Bottom: 1.27,109.25 25.08,109.25 25.08,89.85 1.27,89.85
N$2
  pour Top (rank 2): 18.73,105.73 25.08,105.73 25.08,89.85 1.27,89.85 1.27,105.73
N$3
  pour Top: 1.27,105.73 18.73,105.73 18.73,126.36 1.27,126.36
N$4
  Bottom 0.4: LED11.P 48.53,4.13 R11.2
N$5
  Bottom 0.4: R12.2 42.66,10.22 42.66,10.49 43.07,10.9 LED12.P
N$6
  pour Top (rank 2): 22.23,3.81 44.45,3.81 44.45,23.81 22.23,23.81
N$7
  pour Bottom (rank 2): 28.57,23.81 28.57,3.81 44.45,3.81 44.45,23.81
N$8
  pour Top (rank 2): 73.66,69.85 93.98,69.85 99.06,64.77 99.06,44.45 73.66,44.45
  pour Bottom (rank 2): 73.66,69.85 93.98,69.85 99.06,64.77 99.06,44.45 73.66,44.45
N$9
  pour Top: 84.14,3.81 84.14,23.81 104.78,23.81 104.78,3.81
N$10
  Bottom 0.406: U3.3 15.08,58.12 C5.2
N$11
  pour Bottom (rank 2): 98.42,23.81 98.42,3.81 119.06,3.81 119.06,23.81
N$12
  pour Bottom: 98.42,23.81 98.42,3.81 84.14,3.81 84.14,23.81
N$13
  pour Top: 46.35,3.81 46.35,23.81 65.09,23.81 65.09,3.81
N$14
  pour Top (rank 2): 65.09,23.81 65.09,3.81 82.55,3.81 82.55,23.81
N$15
  pour Bottom (rank 2): 60.33,23.81 82.55,23.81 82.55,3.81 60.33,3.81
N$16
  pour Bottom: 60.33,23.81 60.33,3.81 44.45,3.81 44.45,23.81
N$17
  Top 0.406: U4.3 16.41,40.94 16.1,40.64 C4.2
N$18  (1 unrouted)
  Top 1.016: F15.R2 110.64,42.4 | F15.R1 118.14,42.38 J5.P$4
N$19
  Bottom 0.4: LED10.P 48.53,10.17 R10.2
N$20
  pour Top: 48.26,69.85 48.26,45.72 49.53,44.45 72.39,44.45 72.39,69.85
  pour Bottom: 48.26,69.85 48.26,45.72 49.53,44.45 72.39,44.45 72.39,69.85
N$21
  Bottom 0.4: LED8.P 80.53,5.23 79.85,4.55 79.58,4.55 79.17,4.14 79.17,3.87 R8.2
N$22
  Top 1.27: J6.P$2 62,100.56 63.59,98.97 74.93,98.97 78.73,95.17 J10.86
  Bottom 0.813: J10.86 81.98,96.1 CR2.1
N$23
  Top 1.27: J8.P$2 33.27,102.62 36.83,99.06 41.66,99.06 41.72,99.12 45.04,99.12 J9.86
  Bottom 0.813: J9.86 49.96,96.52 CR1.1
N$24
  Bottom 0.4: LED9.P 79.77,10.9 79.58,10.9 78.47,9.79 R9.2
N$25
  pour Bottom (rank 2): 18.73,109.96 1.27,109.96 1.27,126.36 18.73,126.36
N$26
  Bottom 0.4: LED7.P 84.34,5.46 85.25,4.55 85.52,4.55 85.93,4.14 85.93,3.87 R7.2
N$27
  Bottom 0.4: R6.2 86.47,9.53 85.93,10.07 85.93,10.49 85.52,10.9 85.1,10.9 LED6.P
N$28
  Bottom 0.4: LED5.P 119.97,7.6 R5.2
N$29
  Bottom 0.4: LED4.P 119.62,11.66 R4.2
N$30
  Bottom 0.4: R1.2 42.66,3.87 42.66,4.23 43.07,4.64 LED1.P
N$31
  Bottom 0.4: R2.2 7.73,11.82 LED2.P
N$32
  Bottom 0.4: R3.2 9.41,6.24 LED3.P
N$33
  pour Top: 22.23,3.81 22.23,23.81 6.35,23.81 6.35,3.81
N$34
  pour Bottom: 28.57,23.81 28.57,3.81 6.35,3.81 6.35,23.81
N$35
  Bottom 0.406: C2.2 15.28,72.18 U6.3
N$36
  Bottom 0.4: LED16.P 4.32,76.48 R13.2
N$37
  Bottom 0.4: LED15.P 10.03,75.11 R14.2
N$38
  Bottom 0.4: LED14.P R15.2
N$39
  Bottom 0.4: LED13.P 10.1,39.63 R16.2
N$40
  pour Top: 64.14,121.92 81.6,121.92 81.6,101.28 64.14,101.28
  pour Bottom: 64.14,121.92 64.14,101.28 81.6,101.28 81.6,121.92
N$41
  pour Top (rank 2): 104.78,23.81 119.06,23.81 119.06,3.81 104.78,3.81
N$42
  Top 0.406: U5.3 16.33,56.19 C3.2
N$43
  pour Top: 35.56,116.84 35.56,121.92 52.39,121.92 52.39,101.28 35.56,101.28
  pour Bottom: 35.56,121.92 35.56,101.28 52.39,101.28 52.39,121.92
N$44
  Bottom 0.813: U$2.TRIM 101.47,70.48 R21.2
RST
  Bottom 0.406: SV1.7 90.26,109.31 90.22,109.31 89.42,108.52 89.42,94.69 90.88,93.23 99.06,93.23 101.36,90.92 109.78,90.92 110.58,90.12 110.58,90.08 SV2.5
SCK
  Top 0.4: SV3.1 120.74,74.84 120.74,74.88 116.25,79.38 88.9,79.38 83.82,84.45
  Top 0.406: SV1.5 92.62,104.23 92.67,104.23 95.34,101.56 95.34,96.43 SV5.7 96.52,92.71 95.89,92.08 85.72,92.08 83.82,90.17 83.82,84.45
(copper drawn outside any net)
  shapes: Top area x3

### Text on the board
tPlace: HP2C | HP2 | HP2 | HP2 | HP1C | HP1 | HP1 | HP1 | WFR-2019 | CAN TxRx | PT1 | RST | CS | SCK | MISO | MOSI | +5V IN | PT2 | CS | RST | MOSI | MISO | ARDUINO NANO | HP2 | M4 | M3 | HP1 | +5V IN | SCK | Power / Distribution / Module | MON1 | MON2 | MON3 | MON4 | Excellence. / Endurance. / Enthusiasm. | M4 | MAIN_12V_IN | MON | M3 | 3V3 | M1 | Simplicity. / Integration. / Performance. | GND | M2 | Performance. / Integration. / Simplicity. | 5V_IN | Power / Distribution / Module | M2 | M1 | A1 | A2 | A3 | A4 | B1 | B2 | B3 | B4 | C1 | C2 | C3 | C4 | A3 | B1 | B3 | C1 | C3 | A1 | A4 | B2 | B4 | C2 | C4 | A2
bPlace: Excellence. Endurance. Enthusiasm.
tNames: P-MOD